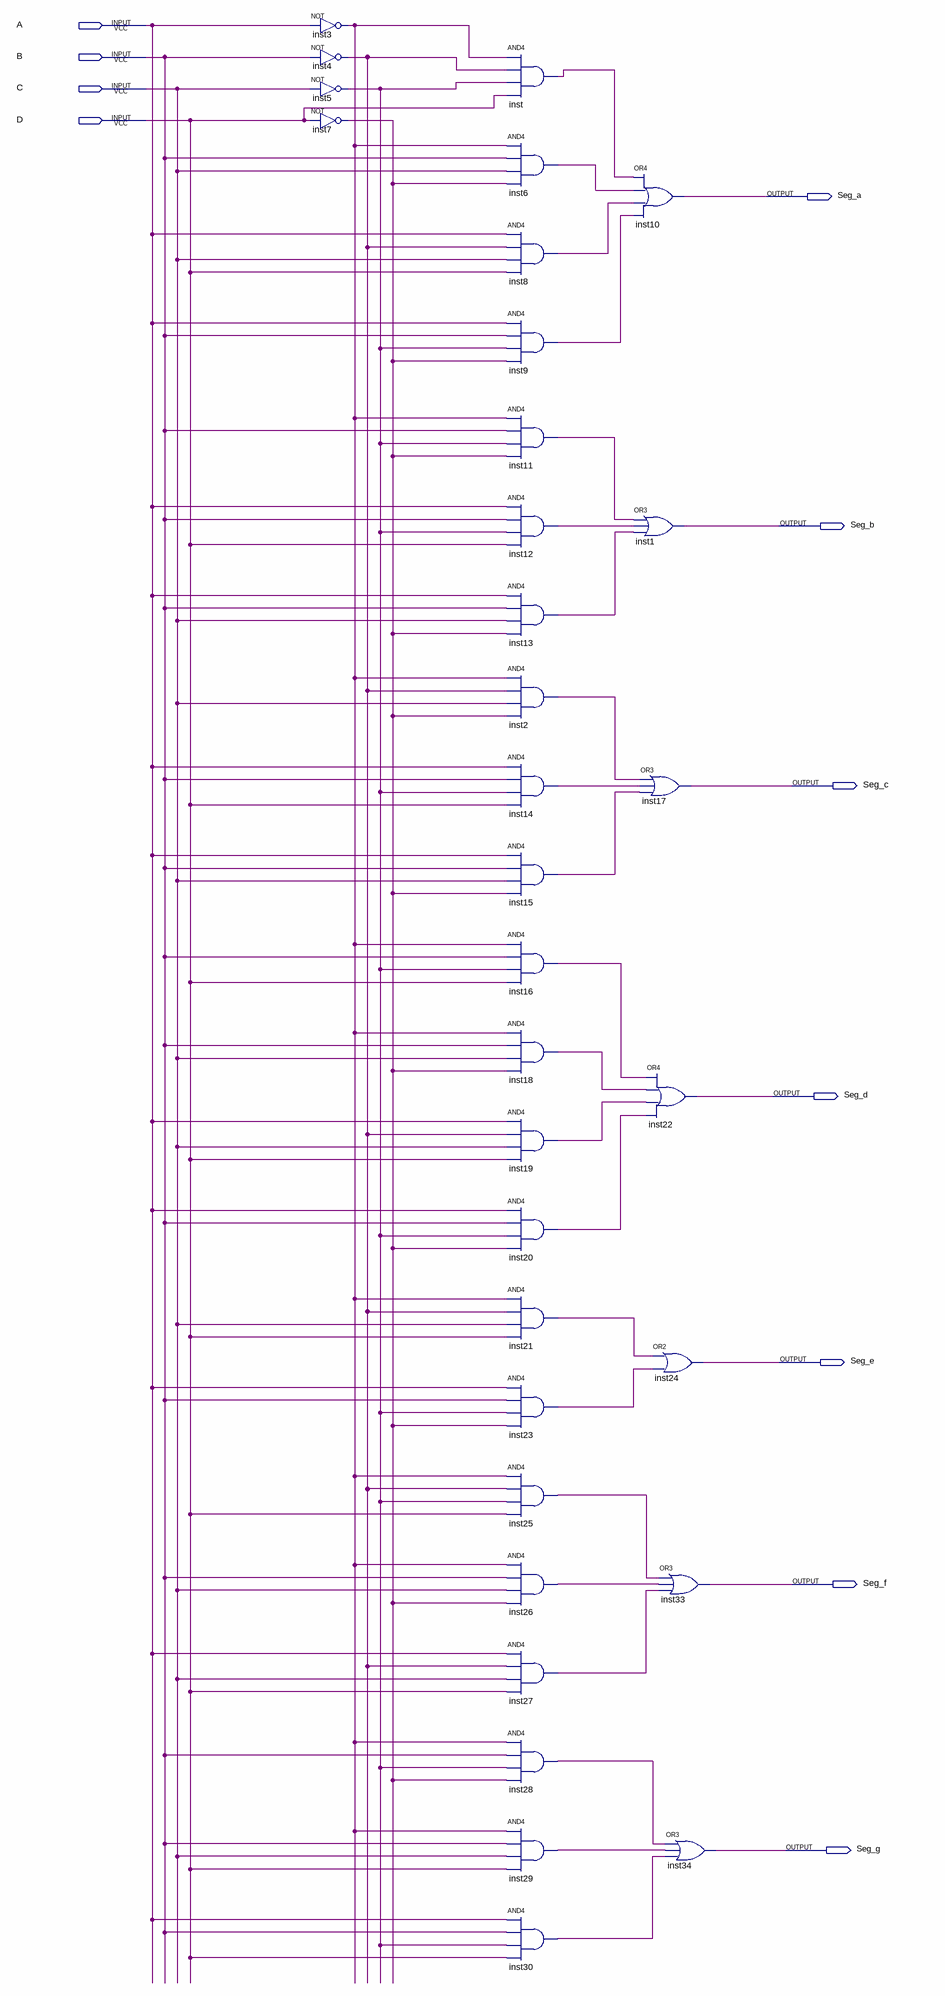
[diagram p0: schematic sheet]
// Quartus schematic segsiete.bdf as structural Verilog: 33 symbols, 11 pins
module segsiete (
  input  A,
  input  B,
  input  C,
  input  D,
  output Seg_a,
  output Seg_b,
  output Seg_c,
  output Seg_d,
  output Seg_e,
  output Seg_f,
  output Seg_g
);

  wire inst2_out, inst3_out, inst4_out, inst5_out, inst6_out, inst7_out, inst8_out, inst9_out, inst11_out,
       inst12_out, inst13_out, inst14_out, inst15_out, inst16_out, inst18_out, inst19_out, inst20_out,
       inst21_out, inst23_out, inst25_out, inst26_out, inst27_out, inst28_out, inst29_out, inst30_out,
       inst_out;

  not inst3 (inst3_out, A);
  not inst4 (inst4_out, B);
  not inst5 (inst5_out, C);
  not inst7 (inst7_out, D);
  and inst (inst_out, inst3_out, inst4_out, inst5_out, D);
  and inst6 (inst6_out, inst3_out, B, C, inst7_out);
  and inst8 (inst8_out, A, inst4_out, C, D);
  and inst9 (inst9_out, A, B, inst5_out, inst7_out);
  and inst11 (inst11_out, inst3_out, B, inst5_out, inst7_out);
  and inst12 (inst12_out, A, B, inst5_out, D);
  and inst13 (inst13_out, A, B, C, inst7_out);
  and inst2 (inst2_out, inst3_out, inst4_out, C, inst7_out);
  and inst14 (inst14_out, A, B, inst5_out, D);
  and inst15 (inst15_out, A, B, C, inst7_out);
  and inst16 (inst16_out, inst3_out, B, inst5_out, D);
  and inst18 (inst18_out, inst3_out, B, C, inst7_out);
  and inst19 (inst19_out, A, inst4_out, C, D);
  and inst20 (inst20_out, A, B, inst5_out, inst7_out);
  and inst21 (inst21_out, inst3_out, inst4_out, C, D);
  and inst23 (inst23_out, A, B, inst5_out, inst7_out);
  and inst25 (inst25_out, inst3_out, inst4_out, inst5_out, D);
  and inst26 (inst26_out, inst3_out, B, C, inst7_out);
  and inst27 (inst27_out, A, inst4_out, C, D);
  and inst28 (inst28_out, inst3_out, B, inst5_out, inst7_out);
  and inst29 (inst29_out, inst3_out, B, C, D);
  and inst30 (inst30_out, A, B, inst5_out, D);
  or inst10 (Seg_a, inst_out, inst6_out, inst8_out, inst9_out);
  or inst1 (Seg_b, inst11_out, inst12_out, inst13_out);
  or inst17 (Seg_c, inst2_out, inst14_out, inst15_out);
  or inst22 (Seg_d, inst16_out, inst18_out, inst19_out, inst20_out);
  or inst24 (Seg_e, inst21_out, inst23_out);
  or inst33 (Seg_f, inst25_out, inst26_out, inst27_out);
  or inst34 (Seg_g, inst28_out, inst29_out, inst30_out);
endmodule
